# Altium project SenseHost.PrjPcb
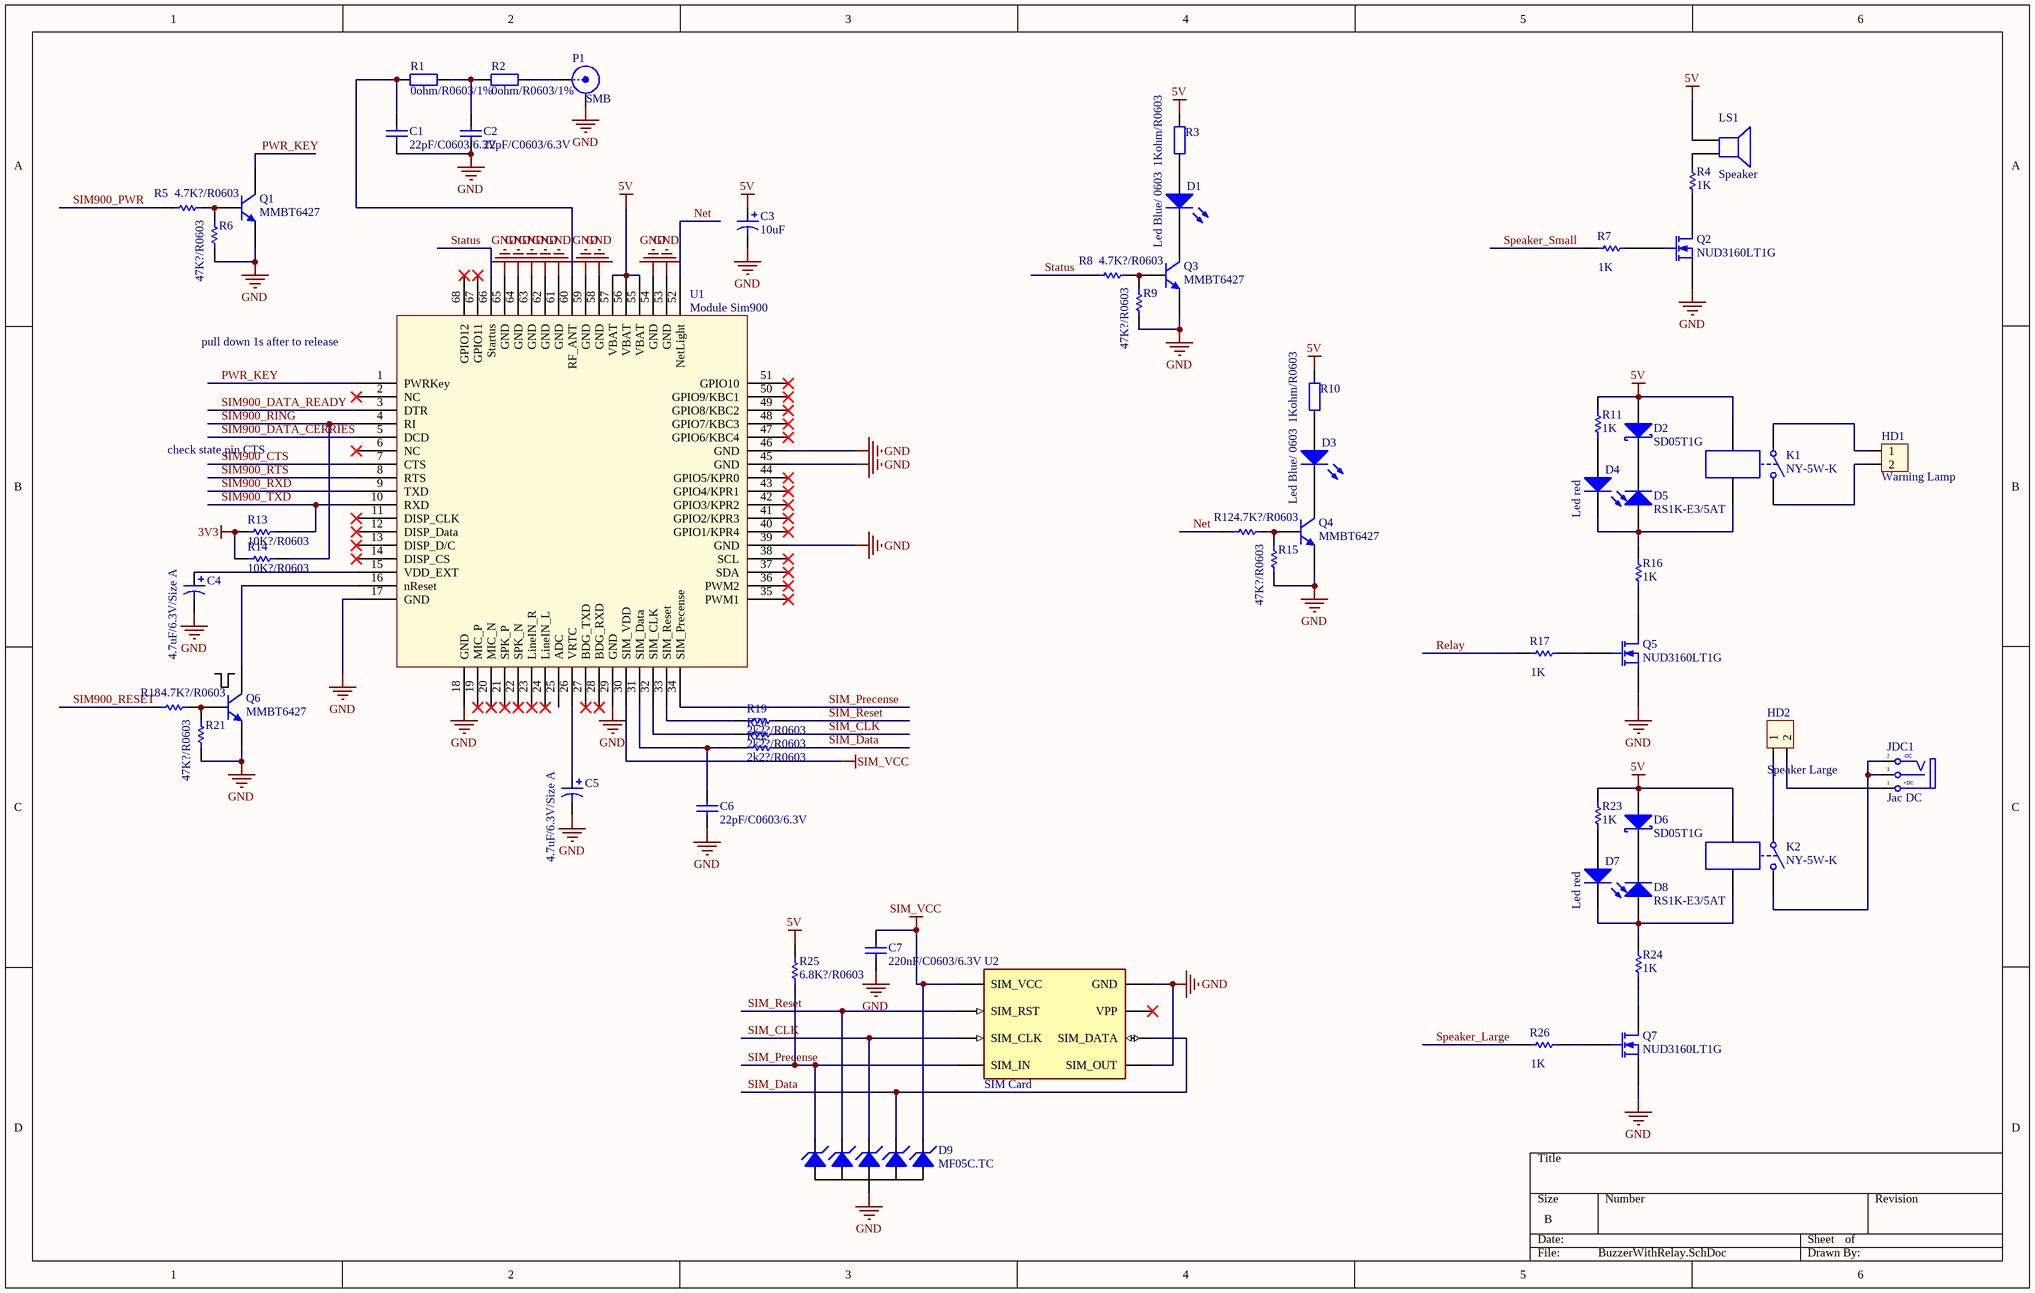
[diagram p0: BuzzerWithRelay.SchDoc]
3 sheets, 160 parts. Net scope: global (net labels, ports and power ports of the same name join across sheets).
Board file: SenseHost.PcbDoc
Sheets:
  BuzzerWithRelay.SchDoc
  MCU_RF.SchDoc
  Power.SchDoc

## Sheet BuzzerWithRelay.SchDoc
size B

### Parts
C1  22pF/C0603/6.3V  [C0603]
C2  22pF/C0603/6.3V  [C0603]
C3  10uF  [Cap size A]
C4  4.7uF/6.3V/Size A  [Cap size A]
C5  4.7uF/6.3V/Size A  [Cap size A]
C6  22pF/C0603/6.3V  [C0603]
C7  220nF/C0603/6.3V  [C0603]
D1  Led Blue/ 0603  [led0603]
D2  SD05T1G  [DO-214AC]
D3  Led Blue/ 0603  [led0603]
D4  Led red  [SM-LED-0805-Red]
D5  RS1K-E3/5AT  [DO-214AC]
D6  SD05T1G  [DO-214AC]
D7  Led red  [SM-LED-0805-Red]
D8  RS1K-E3/5AT  [DO-214AC]
D9  MF05C.TC  [SC70]
HD1  Warning Lamp  [HED2]
HD2  Speaker Large  [HED2]
JDC1  Jac DC  [DC-IN]
K1  NY-5W-K  [Relay NY seri]
K2  NY-5W-K  [Relay NY seri]
LS1  Speaker  [Buzzer]
P1  SMB  [atena MM9329-2700]
Q1  MMBT6427  [SOT 23]
Q2  NUD3160LT1G  [SOT 23]
Q3  MMBT6427  [SOT 23]
Q4  MMBT6427  [SOT 23]
Q5  NUD3160LT1G  [SOT 23]
Q6  MMBT6427  [SOT 23]
Q7  NUD3160LT1G  [SOT 23]
R1  0ohm/R0603/1%  [R0603]
R2  0ohm/R0603/1%  [R0603]
R3  1Kohm/R0603  [R0603]
R4  value 1K  [R0603]  (hidden comment: Res1)
R5  4.7K?/R0603  [R0603]
R6  47K?/R0603  [R0603]
R7  value 1K  [R0603]  (hidden comment: Res1)
R8  4.7K?/R0603  [R0603]
R9  47K?/R0603  [R0603]
R10  1Kohm/R0603  [R0603]
R11  value 1K  [SM-RES-0805]  (hidden comment: Res1)
R12  4.7K?/R0603  [R0603]
R13  10K?/R0603  [R0603]
R14  10K?/R0603  [R0603]
R15  47K?/R0603  [R0603]
R16  value 1K  [SM-RES-0805]  (hidden comment: Res1)
R17  value 1K  [SM-RES-0805]  (hidden comment: Res1)
R18  4.7K?/R0603  [R0603]
R19  2k2?/R0603  [R0603]
R20  2k2?/R0603  [R0603]
R21  47K?/R0603  [R0603]
R22  2k2?/R0603  [R0603]
R23  value 1K  [SM-RES-0805]  (hidden comment: Res1)
R24  value 1K  [SM-RES-0805]  (hidden comment: Res1)
R25  6.8K?/R0603  [R0603]
R26  value 1K  [SM-RES-0805]  (hidden comment: Res1)
U1  Module Sim900  [Sim900]
U2  SIM Card  [SIMCARD]

### Nets
3V3: R13.1 R14.1
5V: C3.1(+) D2.2 D6.2 K1.3 K2.3 LS1.+ R3.2 R10.2 R11.2 R23.2 R25.1 U1.55(VBAT) U1.56(VBAT) U1.57(VBAT)
GND: C1.1 C2.1 C3.2(-) C4.2 C5.2 C6.1 C7.1 D9.2(K) P1.2(Y) Q1.2(E) Q2.2(S) Q3.2(E) Q4.2(E) Q5.2(S) Q6.2(E) Q7.2(S) R6.1 R9.1 R15.1 R21.1 U1.17(GND) U1.18(GND) U1.29(GND) U1.39(GND) U1.45(GND) U1.46(GND) U1.53(GND) U1.54(GND) U1.58(GND) U1.59(GND) U1.61(GND) U1.62(GND) U1.63(GND) U1.64(GND) U1.65(GND) U2.C5(GND) U2.C8(SIM_OUT)
SIM_VCC: C7.2 D9.6(K) U1.30(SIM_VDD) U2.C1(SIM_VCC)
Net: R12.1 U1.52(NetLight)
PWR_KEY: Q1.3(C) U1.1(PWRKey)
Relay: R17.1
SIM900_CTS: U1.7(CTS)
SIM900_DATA_CERRIES: U1.5(DCD)
SIM900_DATA_READY: U1.3(DTR)
SIM900_PWR: R5.1
SIM900_RESET: R18.1
SIM900_RING: R14.2 U1.4(RI)
SIM900_RTS: U1.8(RTS)
SIM900_RXD: U1.9(TXD)
SIM900_TXD: R13.2 U1.10(RXD)
SIM_CLK: D9.4(K) R20.1 U2.C3(SIM_CLK)
SIM_Data: D9.5(K) R22.1 U2.C7(SIM_DATA)
SIM_Precense: D9.1(K) R25.2 U1.34(SIM_Precense) U2.C4(SIM_IN)
SIM_Reset: D9.3(K) R19.1 U2.C2(SIM_RST)
Speaker_Large: R26.1
Speaker_Small: R7.1
Status: R8.1 U1.66(Startus)
NetC1_2: C1.2 R1.2 U1.60(RF_ANT)
NetC2_2: C2.2 R1.1 R2.2
NetC4_1: C4.1 U1.15(VDD_EXT)
NetC5_1: C5.1 U1.26(VRTC)
NetC6_2: C6.2 R22.2 U1.31(SIM_Data)
NetD1_1: D1.1(A) R3.1
NetD1_2: D1.2(K) Q3.3(C)
NetD2_1: D2.1 D5.2(K)
NetD3_1: D3.1(A) R10.1
NetD3_2: D3.2(K) Q4.3(C)
NetD4_1: D4.1(A) R11.1
NetD4_2: D4.2(K) D5.1(A) K1.4 R16.2
NetD6_1: D6.1 D8.2(K)
NetD7_1: D7.1(A) R23.1
NetD7_2: D7.2(K) D8.1(A) K2.4 R24.2
NetHD1_1: HD1.1 K1.1
NetHD1_2: HD1.2 K1.2
NetHD2_1: HD2.1 K2.1
NetHD2_2: HD2.2 JDC1.1(T)
NetJDC1_2: JDC1.2(TN) JDC1.3(S) K2.2
NetLS1_-: LS1.- R4.2
NetP1_1: P1.1(X) R2.1
NetQ1_1: Q1.1(B) R5.2 R6.2
NetQ2_1: Q2.1(G) R7.2
NetQ2_3: Q2.3(D) R4.1
NetQ3_1: Q3.1(B) R8.2 R9.2
NetQ4_1: Q4.1(B) R12.2 R15.2
NetQ5_1: Q5.1(G) R17.2
NetQ5_3: Q5.3(D) R16.1
NetQ6_1: Q6.1(B) R18.2 R21.2
NetQ6_3: Q6.3(C) U1.16(nReset)
NetQ7_1: Q7.1(G) R26.2
NetQ7_3: Q7.3(D) R24.1
NetR19_2: R19.2 U1.33(SIM_Reset)
NetR20_2: R20.2 U1.32(SIM_CLK)

Not connected (* = marked no-connect by the designer): U1 2(NC)* 6(NC)* 11(DISP_CLK)* 12(DISP_Data)* 13(DISP_D/C)* 14(DISP_CS)* 19(MIC_P)* 20(MIC_N)* 21(SPK_P)* 22(SPK_N)* 23(LineIN_R)* 24(LineIN_L)* 25(ADC) 27(BDG_TXD)* 28(BDG_RXD)* 35(PWM1)* 36(PWM2)* 37(SDA)* 38(SCL)* 40(GPIO1/KPR4)* 41(GPIO2/KPR3)* 42(GPIO3/KPR2)* 43(GPIO4/KPR1)* 44(GPIO5/KPR0)* 47(GPIO6/KBC4)* 48(GPIO7/KBC3)* 49(GPIO8/KBC2)* 50(GPIO9/KBC1)* 51(GPIO10)* 67(GPIO11)* 68(GPIO12)*; U2 C6(VPP)*

### Notes on the sheet
- (near U1) pull down 1s after to release
- check state pin CTS
- (in symbol DCIN) -DC; +DC

### Library data of the parts
C1 C2 C6 C7 = Cap: Capacitor; Muf: Murata/Japan; Des: Ceramic Cap; Property: Cap; Price: *
  C1 C2 C6: Ordering: 22pF/C0603/6.3V
  C7: Ordering: 220nF/C0603/6.3V
C3 = 10uF/25V/RADIAL 5X11/20%: Aluminum Electrolytic Capacitors - Leaded 10uF 25V; Manufacturer: Panasonic; Manufacturer Part Number: ECA-1EM100; Tolerance: 20 %; Type: Radial Lead Type; Life: 2000 Hour; Ripple Current: 50 mA; Supplier 1: Mouser; RoHS: RoHS Compliant; Category: Aluminum Electrolytic Capacitors - Leaded; Stock 1: 19378; Pricing 1: 1=0.288, 10=0.117, 100=0.069, 1000=0.061, 2500=0.053, 10000=0.050, 25000=0.048, 50000=0.045 (AUD); Capacitance: 10 uF; Diameter: 5 mm; Dimensions: 5 mm Dia. x 11 mm L; Length: 11 mm; Package / Case: Radial, Can; Packaging: Bulk; Product: General Purpose Electrolytic Capacitors; Series: M; Termination Style: Radial; Voltage Rating DC: 25 V; Brand: Panasonic; Lead Spacing: 2 mm; Lead Style: Straight; Maximum Operating Temperature: + 85 C; Product Category: Radial Electrolytic Aluminum Capacitors; Standard Pack Qty: 200; RoHS - Mouser: Y; Minimum Order Quantity: 1; Reeling: False; ComponentLink1URL: http://www.mouser.com/ds/2/315/ABA0000CE12-465472.pdf; ComponentLink1Description: http://www.mouser.com/ds/2/315/ABA0000CE12-465472.pdf
C4 C5 = Cap Pol1: Polarized Capacitor (Radial); Muf: Vishay; Property: Tantalum Cap; Ordering: 4.7uF/6.3V/Size A; Price: *; Des: *
D1 D3 = LED0: Typical INFRARED GaAs LED; Muf: China Mainland; Ordering: Led Blue/ 0603; Price: *; Des: *; Property: Led
D2 D6 = Transil: Des: SD05T1 Series 7.3V 350W Uni Directiional Transient Voltage Suppressor - SOD-323; Muf: ON; Property: TVS; Ordering: SD05T1G; Value: SD05T1G; Price: 0.09
D4 D7 = LED0: Typical INFRARED GaAs LED; Des: Led singal; Muf: Everlight; Value: Led red; Price: 0.02; Ordering: Led 0805; Property: Led
D5 D8 = Diode: Default Diode; Des: RS1K Series 800 V 1 A Surface Mount Fast Switching Rectifier - DO-214AC; Muf: VISHAY; Value: RS1K-E3/5AT; Property: Diode; Price: 0.05; Ordering: RS1K-E3/5AT
D9 = SMF05C: TVS Diode Array  For ESD and Latch-Up Protection; Muf: SEMTECH/USA; Ordering: MF05C.TC; Price: *; Des: TVS Diode Array; Property: TVS Diode
HD1 HD2 = Hed2: Header 2 (Green); Value: Header 2
JDC1 = DCIN: Jac DC input; Value: Jac DC
K1 K2 = Relay-SPST: Single-Pole Single-Throw Relay; Muf: Fujitsu; Des: General Purpose Relays POWER; Property: Power Relays; Ordering: NY-5W-K; Price: 2.27; Value: NY-5W-K
LS1 = Speaker: Loudspeaker; Published: 24-Mar-1999; LatestRevisionDate: 17-Jul-2002; LatestRevisionNote: Re-released for DXP Platform.; PackageReference: PIN2; Publisher: Altium Limited
P1 = SMB: SMB Straight Connector; LatestRevisionDate: 17-Jul-2002; LatestRevisionNote: Re-released for DXP Platform.; Publisher: Altium Limited
Q1 Q3 Q4 Q6 = NPN: NPN Bipolar Transistor; Muf: Fairchild; Ordering: MMBT6427; Des: *; Property: *; Price: 0.4RMB
Q2 Q5 Q7 = MOSFET-N: SSM3K337R; Des: MOSFET 61V Industrial Load Driver; Muf: ON Semiconductor; Property: Mosfet; Price: 0.57; Ordering: NUD3160LT1G; Value: NUD3160LT1G
R1 R2 = Res2: Resistor; Property: Res; Muf: China Mainland; Ordering: 0ohm/R0603/1%; Des: *; Price: *
R3 R10 = Res2: Resistor; Property: Res; Ordering: 1Kohm/R0603; Vishay/USA: *; Price: 0.023RMB; Des: *
R4 R7 R11 R16 R17 R23 R24 R26 = Res1: Resistor; Published: 8-Jun-2000; LatestRevisionDate: 17-Jul-2002; LatestRevisionNote: Re-released for DXP Platform.; PackageReference: AXIAL-0.3; Publisher: Altium Limited; PackageDescription: Axial Device, Thru-Hole; 2 Leads; 0.3 in Pin Spacing
R5 R6 R8 R9 R12-R15 R18-R22 R25 = Res1: Resistor; Muf: Vishay/USA; Property: Res; Des: *
  R5 R8 R12 R18: Ordering: 4.7K?/R0603
  R6 R9 R15 R21: Ordering: 47K?/R0603
  R13 R14: Ordering: 10K?/R0603
  R19 R20 R22: Ordering: 2k2?/R0603
  R25: Ordering: 6.8K?/R0603
U1 = SIM900: GSM-GPRS; Muf: SimCom; Price: *; Des: *; Property: Module; Ordering: Module Sim900

## Sheet MCU_RF.SchDoc
size B
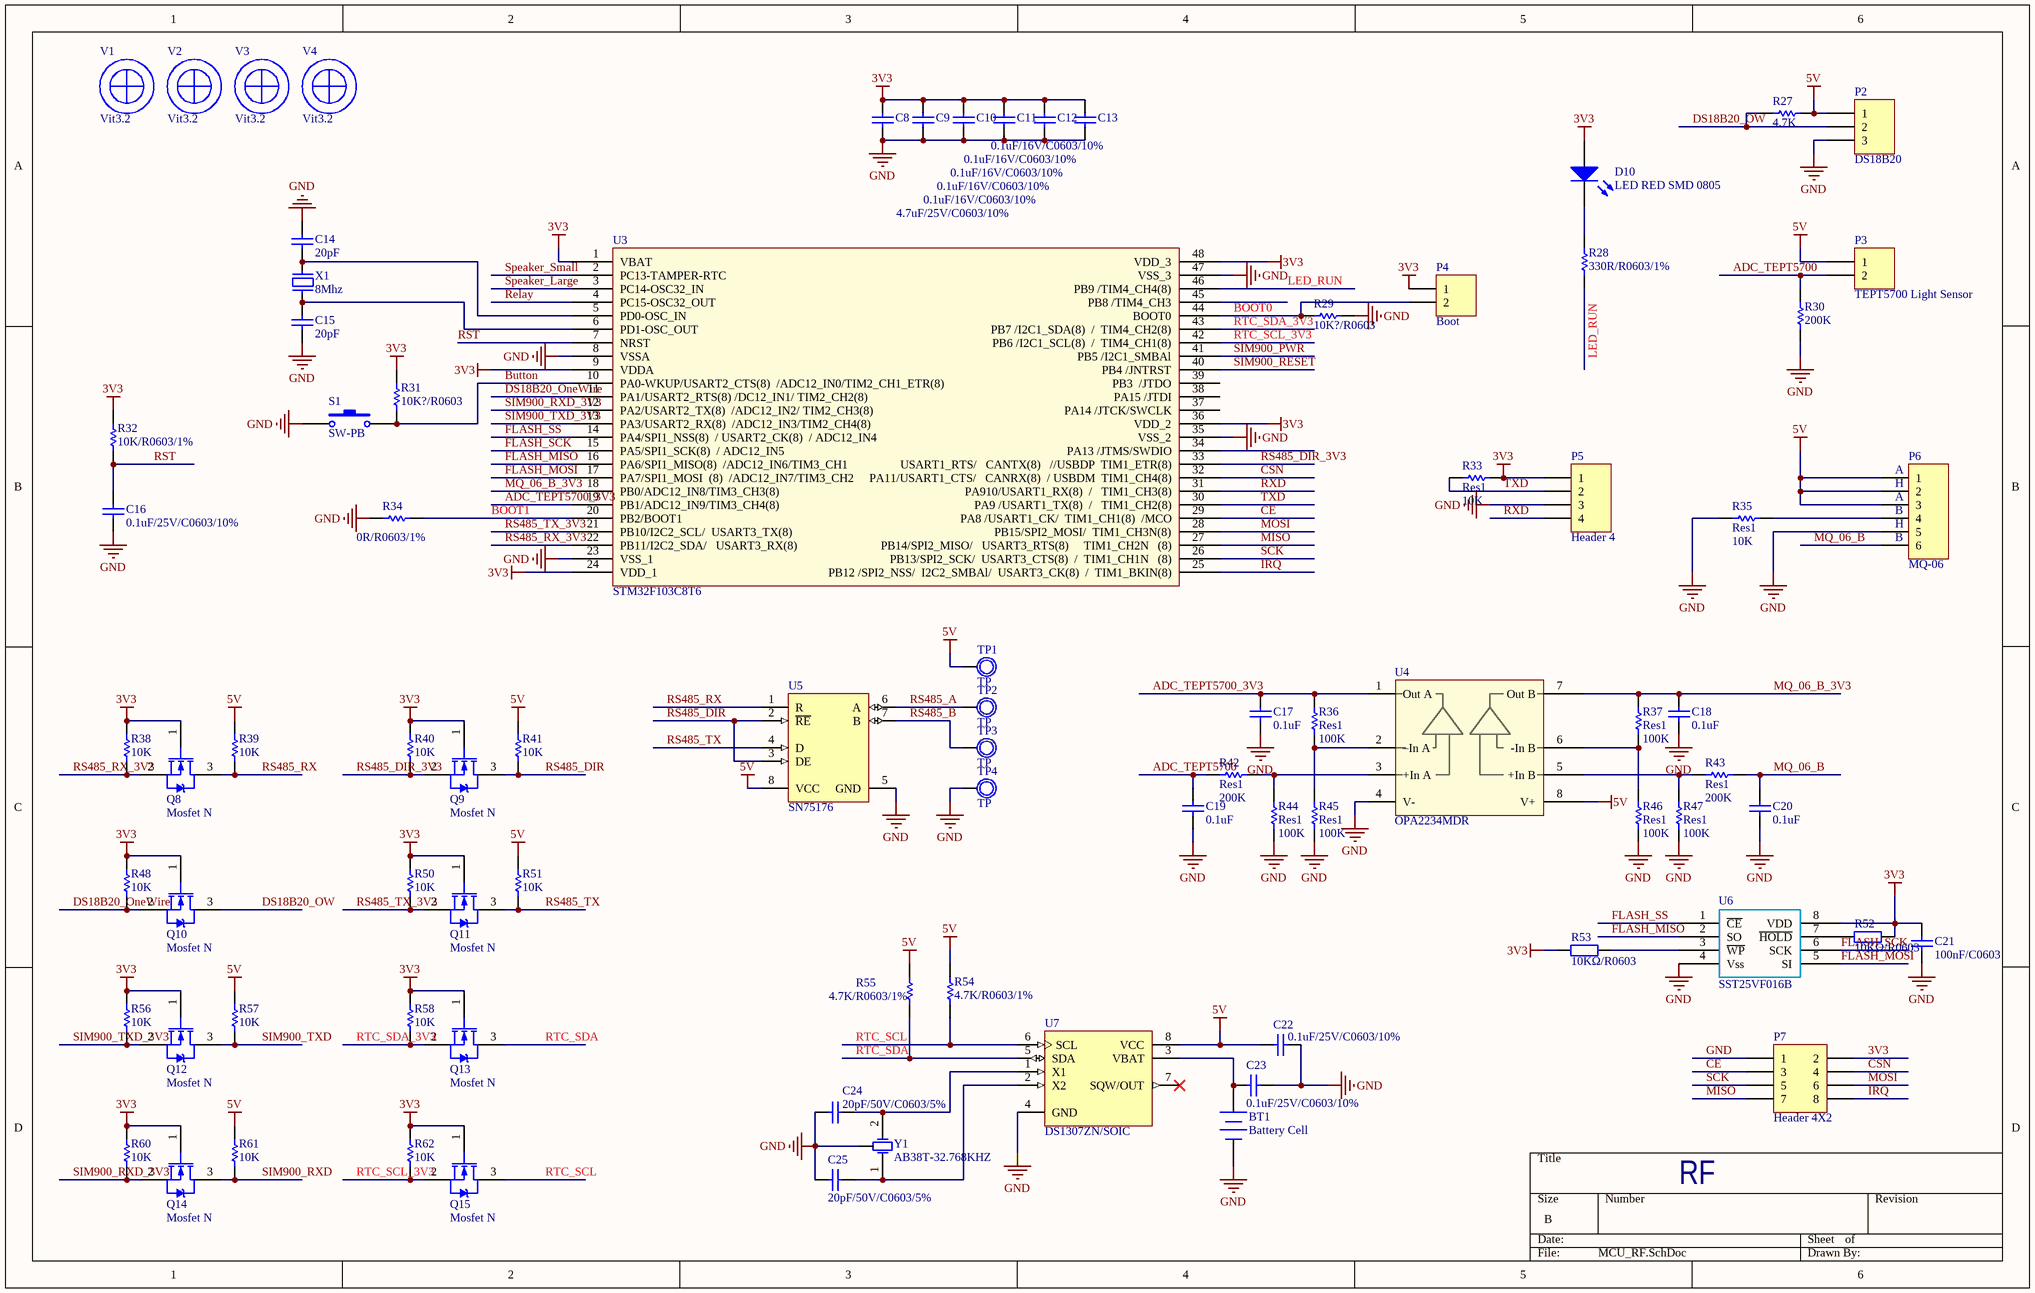
[diagram p1: MCU_RF.SchDoc]

### Parts
BT1  Battery Cell  [Battery CELL_HOLDER]
C8  4.7uF/25V/C0603/10%  [C0603]
C9  0.1uF/16V/C0603/10%  [C0603]
C10  0.1uF/16V/C0603/10%  [C0603]
C11  0.1uF/16V/C0603/10%  [C0603]
C12  0.1uF/16V/C0603/10%  [C0603]
C13  0.1uF/16V/C0603/10%  [C0603]
C14  20pF  [C0603]
C15  20pF  [C0603]
C16  0.1uF/25V/C0603/10%  [C0603]
C17  0.1uF  [C0603]
C18  0.1uF  [C0603]
C19  0.1uF  [C0603]
C20  0.1uF  [C0603]
C21  100nF/C0603  [c0603]
C22  0.1uF/25V/C0603/10%  [C0603]
C23  0.1uF/25V/C0603/10%  [C0603]
C24  20pF/50V/C0603/5%  [C0603]
C25  20pF/50V/C0603/5%  [C0603]
D10  LED RED SMD 0805  [led0805]
P2  DS18B20  [HDR1X3]
P3  TEPT5700 Light Sensor  [LED-5-BLUE]
P4  Boot  [HDR1X2]
P5  Header 4  [HDR1X4]
P6  MQ-06  [MQ-02]
P7  Header 4X2  [HDR2X4]
Q8  Mosfet N  [SOT 23]
Q9  Mosfet N  [SOT 23]
Q10  Mosfet N  [SOT 23]
Q11  Mosfet N  [SOT 23]
Q12  Mosfet N  [SOT 23]
Q13  Mosfet N  [SOT 23]
Q14  Mosfet N  [SOT 23]
Q15  Mosfet N  [SOT 23]
R27  value 4.7K  [SM-RES-0805]  (hidden comment: Res1)
R28  330R/R0603/1%  [R0603]
R29  10K?/R0603  [R0603]
R30  value 200K  [SM-RES-0805]  (hidden comment: Res1)
R31  10K?/R0603  [R0603]
R32  10K/R0603/1%  [R0603]
R33  Res1  value 10K  [R0603]
R34  0R/R0603/1%  [R0603]
R35  Res1  value 10K  [SM-RES-0805]
R36  Res1  value 100K  [R0603]
R37  Res1  value 100K  [R0603]
R38  10K  [R0603]
R39  10K  [R0603]
R40  10K  [R0603]
R41  10K  [R0603]
R42  Res1  value 200K  [R0603]
R43  Res1  value 200K  [R0603]
R44  Res1  value 100K  [R0603]
R45  Res1  value 100K  [R0603]
R46  Res1  value 100K  [R0603]
R47  Res1  value 100K  [R0603]
R48  10K  [R0603]
R50  10K  [R0603]
R51  10K  [R0603]
R52  10KΩ/R0603  [r0603]
R53  10KΩ/R0603  [r0603]
R54  4.7K/R0603/1%  [R0603]
R55  4.7K/R0603/1%  [R0603]
R56  10K  [R0603]
R57  10K  [R0603]
R58  10K  [R0603]
R60  10K  [R0603]
R61  10K  [R0603]
R62  10K  [R0603]
S1  SW-PB  [Button-2pin]
TP1  TP  [TP1]
TP2  TP  [TP1]
TP3  TP  [TP1]
TP4  TP  [TP1]
U3  STM32F103C8T6  [ST_TSQFP50P910X910X160-48N]
U4  OPA2234MDR  [SOP 8Pin]
U5  SN75176  [SOP127P600X175-8N]
U6  SST25VF016B  [SOIC8]
U7  DS1307ZN/SOIC  [SOIC-8]
V1  Vit3.2  [Vit3.2]
V2  Vit3.2  [Vit3.2]
V3  Vit3.2  [Vit3.2]
V4  Vit3.2  [Vit3.2]
X1  8Mhz  [XT2]
Y1  AB38T-32.768KHZ  [ZTA - 38k]

### Nets
3V3: C8.2 C9.2 C10.2 C11.2 C12.2 C13.2 C21.2 D10.1(A) P4.1 P5.1 P7.2 Q8.1(G) Q9.1(G) Q10.1(G) Q11.1(G) Q12.1(G) Q13.1(G) Q14.1(G) Q15.1(G) R31.1 R32.2 R33.2 R38.1 R40.1 R48.1 R50.1 R52.2 R53.1 R56.1 R58.1 R60.1 R62.1 U3.1(VBAT) U3.9(VDDA) U3.24(VDD_1) U3.36(VDD_2) U3.48(VDD_3) U6.8(VDD)
5V: C22.2 P2.1 P3.1 P6.1 P6.2 P6.3 R27.1 R39.1 R41.1 R51.1 R54.2 R55.2 R57.1 R61.1 TP1.1 U4.8(V+) U5.8(VCC) U7.8(VCC)
GND: BT1.2(-) C8.1 C9.1 C10.1 C11.1 C12.1 C13.1 C14.2 C15.1 C16.1 C17.2 C18.2 C19.2 C20.2 C21.1 C22.1 C23.1 C24.1 C25.1 P2.3 P5.3 P6.5 P7.1 R29.1 R30.1 R34.1 R35.1 R44.1 R45.1 R46.1 R47.1 S1.1 TP4.1 U3.8(VSSA) U3.23(VSS_1) U3.35(VSS_2) U3.47(VSS_3) U4.4(V-) U5.5(GND) U6.4(Vss) U7.4(GND) Y1.3(GND)
ADC_TEPT5700: C19.1 P3.2 R30.2 R42.1
ADC_TEPT5700_3V3: C17.1 R36.2 U3.19(PB1/ADC12_IN9/TIM3_CH4(8)) U4.1(Out_A)
BOOT0: P4.2 R29.2 U3.44(BOOT0)
BOOT1: R34.2 U3.20(PB2/BOOT1)
Button: R31.2 S1.2 U3.10(PA0-WKUP/USART2_CTS(8)__/ADC12_IN0/TIM2_CH1_ETR(8))
CE: P7.3 U3.29(PA8_/USART1_CK/__TIM1_CH1(8)__/MCO)
CSN: P7.4 U3.32(PA11/USART1_CTS/___CANRX(8)__/_USBDM__TIM1_CH4(8))
DS18B20_OneWire: Q10.2(S) R48.2 U3.11(PA1/USART2_RTS(8)_/DC12_IN1/_TIM2_CH2(8))
DS18B20_OW: P2.2 Q10.3(D) R27.2
FLASH_MISO: U3.16(PA6/SPI1_MISO(8)__/ADC12_IN6/TIM3_CH1) U6.2(SO)
FLASH_MOSI: U3.17(PA7/SPI1_MOSI__(8)__/ADC12_IN7/TIM3_CH2) U6.5(SI)
FLASH_SCK: U3.15(PA5/SPI1_SCK(8)__/_ADC12_IN5) U6.6(SCK)
FLASH_SS: U3.14(PA4/SPI1_NSS(8)__/_USART2_CK(8)__/_ADC12_IN4) U6.1(~{CE})
IRQ: P7.8 U3.25(PB12_/SPI2_NSS/__I2C2_SMBAl/__USART3_CK(8)__/__TIM1_BKIN(8))
LED_RUN: R28.2 U3.46(PB9_/TIM4_CH4(8))
MISO: P7.7 U3.27(PB14/SPI2_MISO/___USART3_RTS(8)_____TIM1_CH2N___(8))
MOSI: P7.6 U3.28(PB15/SPI2_MOSI/__TIM1_CH3N(8))
MQ_06_B: C20.1 P6.6 R43.2
MQ_06_B_3V3: C18.1 R37.2 U3.18(PB0/ADC12_IN8/TIM3_CH3(8)) U4.7(Out_B)
Relay: U3.4(PC15-OSC32_OUT)
RS485_A: TP2.1 U5.6(A)
RS485_B: TP3.1 U5.7(B)
RS485_DIR: Q9.3(D) R41.2 U5.2(~{RE}) U5.3(DE)
RS485_DIR_3V3: Q9.2(S) R40.2 U3.33(USART1_RTS/___CANTX(8)___//USBDP__TIM1_ETR(8))
RS485_RX: Q8.3(D) R39.2 U5.1(R)
RS485_RX_3V3: Q8.2(S) R38.2 U3.22(PB11/I2C2_SDA/___USART3_RX(8))
RS485_TX: Q11.3(D) R51.2 U5.4(D)
RS485_TX_3V3: Q11.2(S) R50.2 U3.21(PB10/I2C2_SCL/__USART3_TX(8))
RST: C16.2 R32.1 U3.7(NRST)
RTC_SCL: Q15.3(D) R54.1 U7.6(SCL)
RTC_SCL_3V3: Q15.2(S) R62.2 U3.42(PB6_/I2C1_SCL(8)__/__TIM4_CH1(8))
RTC_SDA: Q13.3(D) R55.1 U7.5(SDA)
RTC_SDA_3V3: Q13.2(S) R58.2 U3.43(PB7_/I2C1_SDA(8)__/__TIM4_CH2(8))
RXD: P5.4 U3.31(PA910/USART1_RX(8)__/___TIM1_CH3(8))
SCK: P7.5 U3.26(PB13/SPI2_SCK/__USART3_CTS(8)__/__TIM1_CH1N___(8))
SIM900_PWR: U3.41(PB5_/I2C1_SMBAl)
SIM900_RESET: U3.40(PB4_/JNTRST)
SIM900_RXD: Q14.3(D) R61.2
SIM900_RXD_3V3: Q14.2(S) R60.2 U3.12(PA2/USART2_TX(8)__/ADC12_IN2/_TIM2_CH3(8))
SIM900_TXD: Q12.3(D) R57.2
SIM900_TXD_3V3: Q12.2(S) R56.2 U3.13(PA3/USART2_RX(8)__/ADC12_IN3/TIM2_CH4(8))
Speaker_Large: U3.3(PC14-OSC32_IN)
Speaker_Small: U3.2(PC13-TAMPER-RTC)
TXD: P5.2 R33.1 U3.30(PA9_/USART1_TX(8)__/___TIM1_CH2(8))
NetBT1_1: BT1.1(+) C23.2 U7.3(VBAT)
NetC14_1: C14.1 U3.5(PD0-OSC_IN) X1.2
NetC15_2: C15.2 U3.6(PD1-OSC_OUT) X1.1
NetC24_2: C24.2 U7.1(X1) Y1.2(OSC2)
NetC25_2: C25.2 U7.2(X2) Y1.1(OSC1)
NetD10_2: D10.2(K) R28.1
NetP6_4: P6.4 R35.2
NetR36_1: R36.1 R45.2 U4.2(–In_A)
NetR37_1: R37.1 R46.2 U4.6(-In_B)
NetR42_2: R42.2 R44.2 U4.3(+In_A)
NetR43_1: R43.1 R47.2 U4.5(+In_B)
NetR52_1: R52.1 U6.7(~{HOLD})
NetR53_2: R53.2 U6.3(~{WP})

Not connected (* = marked no-connect by the designer): U3 34(PA13_/JTMS/SWDIO) 37(PA14_/JTCK/SWCLK) 38(PA15_/JTDI) 39(PB3__/JTDO) 45(PB8_/TIM4_CH3); U7 7(SQW/OUT)*

### Notes on the sheet
- (near P6) A
- (near P6) H
- (near P6) B
- RF

### Library data of the parts
BT1 = Battery Holder Cell 20mm: HOLDER COINCELL 2032 RETAINRCLIP; Manufacturer: MPD (Memory Protection Devices); Manufacturer Part Number: BS-7; Battery Type, Function: Coin Cell, Holder; Style: Holder (Open); Battery Cell Size: Coin, 20.0mm; Number of Cells: 1; Battery Series: 2032; Supplier 1: Digi-Key; RoHS: RoHS Compliant; Category: Battery Products; Stock 1: 37883; Pricing 1: 1=0.77, 10=0.71, 100=0.64, 500=0.58, 1000=0.46 (USD); Mounting Type: PCB, Through Hole; Termination Style: PC Pin; Height Above Board: 0.354" (9.00mm); Operating Temperature: -55°C ~ 105°C; ComponentLink1URL: http://www.memoryprotectiondevices.com/datasheets/BS-7-datasheet.pdf; ComponentLink1Description: http://www.memoryprotectiondevices.com/datasheets/BS-7-datasheet.pdf; Supplier Part Number 1: BS-7-ND
C8 = 4.7uF/25V/C0603/10%: CAP CER 4.7UF 25V 10% X6S 0603; Manufacturer: Murata Electronics North America; Manufacturer Part Number: GRM188C81E475KE11D; Capacitance: 4.7µF; Supplier 1: Digi-Key; RoHS: RoHS Compliant; Category: Capacitors; Stock 1: 57548; Pricing 1: 1=0.42, 10=0.368, 50=0.2236, 100=0.1841, 250=0.14728, 500=0.13414, 1000=0.12098 (USD); Packaging: Digi-Reel®; Tolerance: ±10%; Voltage - Rated: 25V; Temperature Coefficient: X6S; Mounting Type: Surface Mount, MLCC; Operating Temperature: -55°C ~ 105°C; Applications: General Purpose; Ratings: -; Package / Case: 0603 (1608 Metric); Size / Dimension: 0.063" L x 0.031" W (1.60mm x 0.80mm); Height - Seated (Max): -; Thickness (Max): 0.039" (1.00mm); Lead Spacing: -; Features: -; Lead Style: -; ComponentLink1URL: http://www.murata.com/~/media/webrenewal/support/library/catalog/products/capacitor/mlcc/c02e.ashx; ComponentLink1Description: http://www.murata.com/~/media/webrenewal/support/library/catalog/products/capacitor/mlcc/c02e.ashx
C9-C13 = 0.1uF/16V/C0603/10%: CAP CER 0.1UF 16V 10% X7R 0603; Manufacturer: Kemet; Manufacturer Part Number: C0603C104K4RACTU; Capacitance: 0.1µF; Supplier 1: Digi-Key; RoHS: RoHS Compliant; Category: Capacitors; Stock 1: 2315544; Pricing 1: 1=0.1, 10=0.022, 25=0.0156, 50=0.012, 100=0.0101, 250=0.00828, 1000=0.0054 (USD); Packaging: Cut Tape (CT); Tolerance: ±10%; Voltage - Rated: 16V; Temperature Coefficient: X7R; Mounting Type: Surface Mount, MLCC; Operating Temperature: -55°C ~ 125°C; Applications: General Purpose; Ratings: -; Package / Case: 0603 (1608 Metric); Size / Dimension: 0.063" L x 0.031" W (1.60mm x 0.80mm); Height - Seated (Max): -; Thickness (Max): 0.034" (0.87mm); Lead Spacing: -; Features: -; Lead Style: -; ComponentLink1URL: http://www.kemet.com/docfinder?Partnumber=C0603C104K4RACTU; ComponentLink1Description: http://www.kemet.com/docfinder?Partnumber=C0603C104K4RACTU; Supplier Part Number 1: 399-1096-1-ND
C14 C15 = Cap: Capacitor; Ordering: 10pF/C0603/6.3V; Muf: Murata/Japan; Des: Ceramic Cap; Property: Cap; Price: *
C16-C20 C22 C23 = 0.1uF/25V/C0603/10%: CAP CER 0.1UF 25V 10% X7R 0603; Manufacturer: Murata Electronics North America; Manufacturer Part Number: GRM188R71E104KA01D; Capacitance: 0.1µF; Supplier 1: Digi-Key; RoHS: RoHS Compliant; Category: Capacitors; Stock 1: 8148157; Pricing 1: 1=0.1, 10=0.019, 50=0.0104, 100=0.0088, 250=0.0072, 500=0.00616, 1000=0.0048 (USD); Packaging: Cut Tape (CT); Tolerance: ±10%; Voltage - Rated: 25V; Temperature Coefficient: X7R; Mounting Type: Surface Mount, MLCC; Operating Temperature: -55°C ~ 125°C; Applications: General Purpose; Ratings: -; Package / Case: 0603 (1608 Metric); Size / Dimension: 0.063" L x 0.031" W (1.60mm x 0.80mm); Height - Seated (Max): -; Thickness (Max): 0.035" (0.90mm); Lead Spacing: -; Features: -; Lead Style: -; ComponentLink1URL: http://www.murata.com/~/media/webrenewal/support/library/catalog/products/capacitor/mlcc/c02e.ashx; ComponentLink1Description: http://www.murata.com/~/media/webrenewal/support/library/catalog/products/capacitor/mlcc/c02e.ashx
C21 = Cap: Capacitor; Published: 8-Jun-2000; LatestRevisionDate: 17-Jul-2002; LatestRevisionNote: Re-released for DXP Platform.; PackageReference: RAD-0.3; Publisher: Altium Limited; Value: 100nF/C0603
C24 C25 = 20pF/50V/C0603/5%: CAP CER 20PF 50V 5% NP0 0603; Manufacturer: Samsung Electro-Mechanics America, Inc.; Manufacturer Part Number: CL10C200JB8NNNC; Temperature Coefficient: C0G, NP0; Supplier 1: Digi-Key; RoHS: RoHS Compliant; Category: Capacitors; Stock 1: 129313; Pricing 1: 1=0.1, 10=0.031, 25=0.0216, 100=0.0141, 500=0.00986, 1000=0.00768 (USD); Packaging: Cut Tape (CT); Capacitance: 20pF; Tolerance: ±5%; Voltage - Rated: 50V; Mounting Type: Surface Mount, MLCC; Operating Temperature: -55°C ~ 125°C; Applications: General Purpose; Ratings: -; Package / Case: 0603 (1608 Metric); Size / Dimension: 0.063" L x 0.031" W (1.60mm x 0.80mm); Height - Seated (Max): -; Thickness (Max): 0.035" (0.90mm); Lead Spacing: -; Features: -; Lead Style: -; ComponentLink1URL: http://www.samsungsem.com/kr/support/product-search/mlcc/CL10C200JB8NNNC.jsp; ComponentLink1Description: http://www.samsungsem.com/kr/support/product-search/mlcc/CL10C200JB8NNNC.jsp
D10 = LED RED SMD 0805: LED RED DIFFUSED 0805 SMD; Manufacturer: OSRAM Opto Semiconductors Inc.; Manufacturer Part Number: LH R974-LP-1; Wavelength - Dominant: 645nm; Wavelength - Peak: 660nm; Millicandela Rating: 41mcd; Voltage - Forward (Vf) (Typ): 1.8V; Current - Test: 20mA; Viewing Angle: 160°; Lens Color: White; Lens Style/Size: Rectangle with Flat Top, 1.30mm x 1.25mm; Supplier 1: Digi-Key; RoHS: RoHS Compliant; Category: Optoelectronics; Stock 1: 72062; Pricing 1: 1=0.26, 10=0.207, 25=0.1792, 100=0.1131, 250=0.0754, 500=0.06408, 1000=0.049 (USD); Packaging: Cut Tape (CT); Color: Red; Lens Transparency: Diffused; Package / Case: 0805 (2012 Metric); Supplier Device Package: *; Size / Dimension: 2.00mm L x 1.25mm W; Height (Max): 0.90mm; Mounting Type: Surface Mount; ComponentLink1URL: http://www.osram-os.com/Graphics/XPic8/00078869_0.pdf; ComponentLink1Description: http://www.osram-os.com/Graphics/XPic8/00078869_0.pdf
P2 = Header 3: Header, 3-Pin; LatestRevisionDate: 17-Jul-2002; LatestRevisionNote: Re-released for DXP Platform.; Publisher: Altium Limited
P3 P4 = Header 2: Header, 2-Pin; LatestRevisionDate: 17-Jul-2002; LatestRevisionNote: Re-released for DXP Platform.; Publisher: Altium Limited
P5 = Header 4: Header, 4-Pin; LatestRevisionDate: 17-Jul-2002; LatestRevisionNote: Re-released for DXP Platform.; Publisher: Altium Limited
P6 = Header 6: Header, 6-Pin; LatestRevisionDate: 17-Jul-2002; LatestRevisionNote: Re-released for DXP Platform.; Publisher: Altium Limited
P7 = Header 4X2: Header, 4-Pin, Dual row; LatestRevisionDate: 17-Jul-2002; LatestRevisionNote: Re-released for DXP Platform.; Publisher: Altium Limited
R27 R30 R33 R35-R37 R42-R47 = Res1: Resistor; Published: 8-Jun-2000; LatestRevisionDate: 17-Jul-2002; LatestRevisionNote: Re-released for DXP Platform.; PackageReference: AXIAL-0.3; Publisher: Altium Limited; PackageDescription: Axial Device, Thru-Hole; 2 Leads; 0.3 in Pin Spacing
R28 = 330R/R0603/1%: RES SMD 330 OHM 1% 1/10W 0603; Manufacturer: Yageo; Manufacturer Part Number: RC0603FR-07330RL; Resistance (Ohms): 330; Power (Watts): 0.1W, 1/10W; Temperature Coefficient: ±100ppm/°C; Supplier 1: Digi-Key; RoHS: RoHS Compliant; Category: Resistors; Stock 1: 464448; Pricing 1: 1=0.1, 10=0.014, 25=0.01, 100=0.0057, 250=0.00436, 500=0.00348, 1000=0.00257, 2500=0.00223 (USD); Packaging: Cut Tape (CT); Tolerance: ±1%; Composition: Thick Film; Features: Moisture Resistant; Operating Temperature: -55°C ~ 155°C; Package / Case: 0603 (1608 Metric); Supplier Device Package: 0603; Size / Dimension: 0.063" L x 0.031" W (1.60mm x 0.80mm); Height: 0.022" (0.55mm); Number of Terminations: 2; ComponentLink1URL: http://www.yageo.com/NewPortal/yageodocoutput?fileName=/pdf/R-Chip/PYu-RC_Group_51_RoHS_L_3.pdf; ComponentLink1Description: http://www.yageo.com/NewPortal/yageodocoutput?fileName=/pdf/R-Chip/PYu-RC_Group_51_RoHS_L_3.pdf
R29 R31 = Res1: Resistor; Muf: Vishay/USA; Property: Res; Ordering: 10K?/R0603; Des: *
R32 = 10M/R0603/1%: RES SMD 10M OHM 1% 1/10W 0603; Manufacturer: Yageo; Manufacturer Part Number: RC0603FR-0710ML; Power (Watts): 0.1W, 1/10W; Temperature Coefficient: ±100ppm/°C; Supplier 1: Digi-Key; RoHS: RoHS Compliant; Category: Resistors; Stock 1: 620000; Pricing 1: 5000=0.00175, 10000=0.00152, 25000=0.00133, 50000=0.00122, 125000=0.0012 (USD); Packaging: Tape & Reel (TR); Resistance (Ohms): 10M; Tolerance: ±1%; Composition: Thick Film; Features: Moisture Resistant; Operating Temperature: -55°C ~ 155°C; Package / Case: 0603 (1608 Metric); Supplier Device Package: 0603; Size / Dimension: 0.063" L x 0.031" W (1.60mm x 0.80mm); Height: 0.022" (0.55mm); Number of Terminations: 2; ComponentLink1URL: http://www.yageo.com/NewPortal/yageodocoutput?fileName=/pdf/R-Chip/PYu-RC_Group_51_RoHS_L_3.pdf; ComponentLink1Description: http://www.yageo.com/NewPortal/yageodocoutput?fileName=/pdf/R-Chip/PYu-RC_Group_51_RoHS_L_3.pdf; Supplier Part Number 1: 311-10.0MHRTR-ND
R34 = 0R/R0603/1%: RES SMD 0.01 OHM 1% 1/10W 0603; Manufacturer: Yageo; Manufacturer Part Number: RL0603FR-070R01L; Resistance (Ohms): 0.01; Power (Watts): 0.1W, 1/10W; Temperature Coefficient: ±1500ppm/°C; Supplier 1: Digi-Key; RoHS: RoHS Compliant; Category: Resistors; Stock 1: 30355; Pricing 1: 1=0.76, 10=0.546, 25=0.426, 100=0.2839, 250=0.24024, 500=0.19656, 1000=0.15288, 2500=0.14742 (USD); Packaging: Cut Tape (CT); Tolerance: ±1%; Composition: Thick Film; Features: Current Sense, Moisture Resistant; Operating Temperature: -55°C ~ 155°C; Package / Case: 0603 (1608 Metric); Supplier Device Package: 0603; Size / Dimension: 0.063" L x 0.031" W (1.60mm x 0.80mm); Height: 0.022" (0.55mm); Number of Terminations: 2; ComponentLink1URL: http://www.yageo.com/documents/recent/PYu-RL_Group_521_RoHS_L_1.pdf; ComponentLink1Description: http://www.yageo.com/documents/recent/PYu-RL_Group_521_RoHS_L_1.pdf; Supplier Part Number 1: 311-.01QCT-ND
R38-R41 R48 R50 R51 R54-R58 R60-R62 = 4.7K/R0603/1%: RES SMD 4.7K OHM 1% 1/10W 0603; Manufacturer: Yageo; Manufacturer Part Number: RC0603FR-074K7L; Power (Watts): 0.1W, 1/10W; Temperature Coefficient: ±100ppm/°C; Supplier 1: Digi-Key; RoHS: RoHS Compliant; Category: Resistors; Stock 1: 3295420; Pricing 1: 1=0.1, 10=0.014, 25=0.01, 100=0.0057, 250=0.00436, 500=0.00348, 1000=0.00257, 2500=0.00223 (USD); Packaging: Cut Tape (CT); Resistance (Ohms): 4.7k; Tolerance: ±1%; Composition: Thick Film; Features: Moisture Resistant; Operating Temperature: -55°C ~ 155°C; Package / Case: 0603 (1608 Metric); Supplier Device Package: 0603; Size / Dimension: 0.063" L x 0.031" W (1.60mm x 0.80mm); Height: 0.022" (0.55mm); Number of Terminations: 2; ComponentLink1URL: http://www.yageo.com/NewPortal/yageodocoutput?fileName=/pdf/R-Chip/PYu-RC_Group_51_RoHS_L_3.pdf; ComponentLink1Description: http://www.yageo.com/NewPortal/yageodocoutput?fileName=/pdf/R-Chip/PYu-RC_Group_51_RoHS_L_3.pdf; Supplier Part Number 1: 311-4.70KHRCT-ND
R52 R53 = Res2: Resistor; Ordering: 10KΩ/R0603; Muf: *; Property: Resistor; Des: *; Price: *
S1 = SW-PB: Switch; Published: 24-Mar-1999; LatestRevisionDate: 17-Jul-2002; LatestRevisionNote: Re-released for DXP Platform.; PackageReference: SPST-2; Publisher: Altium Limited
TP1-TP4 = TP1: Test Point; Value: Test Point
U3 = STM32F103C8T6: Medium-density performance line ARM-based 32-bit MCU with 64 or  128 KB Flash, USB, CAN, 7 timers, 2 ADCs, 9 communication interfaces
U4 = OPA2234M: LOW-POWER, PRECISION  SINGLE-SUPPLY OPERATIONAL AMPLIFIERS; Muf: TI/USA; Property: IC; Des: LOW-POWER, PRECISION  SINGLE-SUPPLY OPERATIONAL AMPLIFIERS; Ordering: OPA2234MDR; Price: 5RMB
U5 = SN75176_RS485: RS485 Interface
U7 = DS1307ZN+T&R: IC RTC CLK/CALENDAR I2C 8-SOIC; Manufacturer: Maxim Integrated; Memory Size: 56B; Time Format: HH:MM:SS (12/24 hr); Date Format: YY-MM-DD-dd; Interface: I²C, 2-Wire Serial; Voltage - Supply: 4.5 V ~ 5.5 V; Voltage - Supply, Battery: 2 V ~ 3.5 V; Current - Timekeeping (Max): 200µA @ 5V; Supplier 1: Digi-Key; Manufacturer Part Number: DS1307ZN+T&R; RoHS: RoHS Compliant; Category: Integrated Circuits (ICs); Stock 1: 12500; Pricing 1: 2500=1.62792 (USD); Packaging: Tape & Reel (TR); Type: Clock/Calendar; Features: Leap Year, NVSRAM, Square Wave Output; Operating Temperature: -40°C ~ 85°C; Mounting Type: Surface Mount; Package / Case: 8-SOIC (0.154", 3.90mm Width); Supplier Device Package: 8-SOIC N; ComponentLink1URL: http://datasheets.maximintegrated.com/en/ds/DS1307.pdf; ComponentLink1Description: http://datasheets.maximintegrated.com/en/ds/DS1307.pdf
X1 = XT2: Crystal For all Crystal 2pin.; Value: 4Mhz
Y1 = AB38T-32.768KHZ: CRYSTAL 32.7680KHZ 12.5PF T/H; Manufacturer: Abracon LLC; Frequency Tolerance: ±20ppm; ESR (Equivalent Series Resistance): 30 kOhm; Operating Mode: Fundamental; Supplier 1: Digi-Key; Manufacturer Part Number: AB38T-32.768KHZ; RoHS: RoHS Compliant; Category: Crystals and Oscillators; Stock 1: 38720; Pricing 1: 1=0.17, 10=0.145, 50=0.1306, 100=0.116, 500=0.1102, 1000=0.0928, 2500=0.087, 5000=0.0841, 10000=0.0812 (USD); Packaging: Bulk; Type: kHz Crystal (Tuning Fork); Frequency: 32.768kHz; Frequency Stability: -; Load Capacitance: 12.5pF; Operating Temperature: -10°C ~ 60°C; Ratings: -; Mounting Type: Through Hole; Package / Case: Cylindrical Can, Radial; Size / Dimension: 0.126" Dia x 0.330" L (3.20mm x 8.30mm); Height: 0.327" (8.30mm); ComponentLink1URL: http://www.abracon.com/Resonators/AB38T.pdf; ComponentLink1Description: http://www.abracon.com/Resonators/AB38T.pdf

## Sheet Power.SchDoc
size A
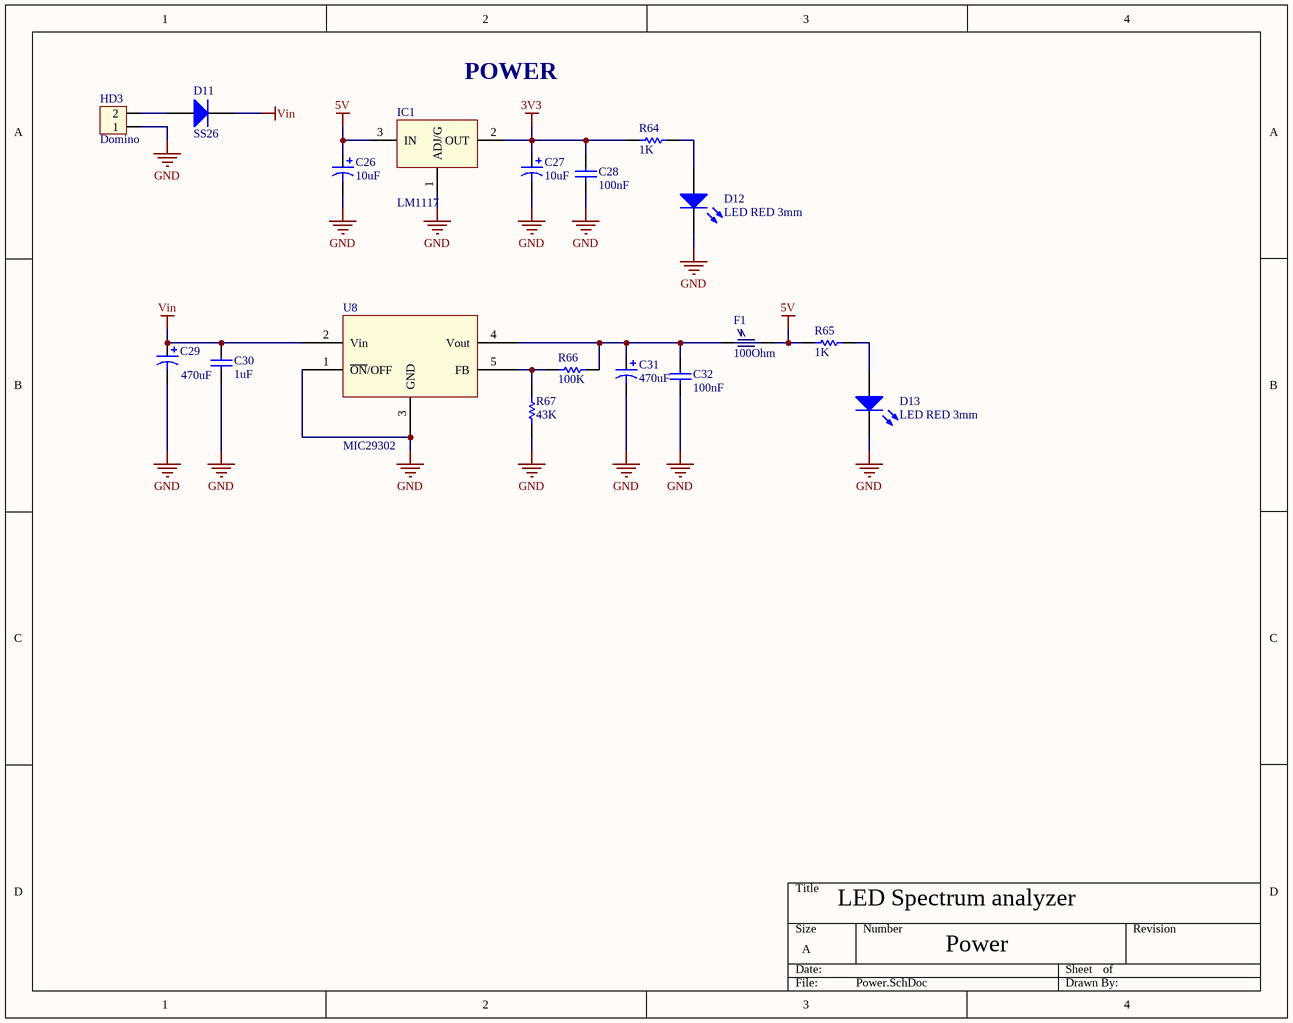
[diagram p2: Power.SchDoc]

### Parts
C26  10uF  [Cap size C]
C27  10uF  [Cap size C]
C28  100nF  [C0805]
C29  470uF  [Cap size X]
C30  1uF  [C0805]
C31  470uF  [Cap size X]
C32  100nF  [C0805]
D11  SS26  [DO-214AA SMB]
D12  LED RED 3mm  [led0805]
D13  LED RED 3mm  [led0805]
F1  100Ohm  [BL02RN1]
HD3  Domino  [HED2]
IC1  LM1117  [SOT223-4N]
R64  1K  [R0805]
R65  1K  [R0805]
R66  100K  [R0805]
R67  43K  [R0805]
U8  MIC29302  [TO-263 5pin]

### Nets
3V3: C27.1(+) C28.2 IC1.2(OUT) R64.2
5V: C26.1(+) F1.2(out) IC1.3(IN) R65.2
GND: C26.2(-) C27.2(-) C28.1 C29.2 C30.1 C31.2(-) C32.1 D12.2(K) D13.2(K) HD3.1 IC1.1(ADJ/G) R67.1 U8.1(~{ON}/OFF) U8.3(GND) U8.6(TAP)
Vin: C29.1 C30.2 D11.2(K) U8.2(Vin)
NetC31_1: C31.1(+) C32.2 F1.1(in) R66.1 U8.4(Vout)
NetD11_1: D11.1(A) HD3.2
NetD12_1: D12.1(A) R64.1
NetD13_1: D13.1(A) R65.1
NetR66_2: R66.2 R67.2 U8.5(FB)

### Notes on the sheet
- POWER
- LED Spectrum analyzer
- Power

### Library data of the parts
C26 C27 C31 = 10uF/25V/RADIAL 5X11/20%: as C3 on sheet BuzzerWithRelay; Supplier 1: Mouser; RoHS: RoHS Compliant; Category: Aluminum Electrolytic Capacitors - Leaded; Stock 1: 19378; Pricing 1: 1=0.288, 10=0.117, 100=0.069, 1000=0.061, 2500=0.053, 10000=0.050, 25000=0.048, 50000=0.045 (AUD); Capacitance: 10 uF; Diameter: 5 mm; Dimensions: 5 mm Dia. x 11 mm L; Length: 11 mm; Package / Case: Radial, Can; Packaging: Bulk; Product: General Purpose Electrolytic Capacitors; Series: M; Termination Style: Radial; Voltage Rating DC: 25 V; Brand: Panasonic; Lead Spacing: 2 mm; Lead Style: Straight; Maximum Operating Temperature: + 85 C; Product Category: Radial Electrolytic Aluminum Capacitors; Standard Pack Qty: 200; RoHS - Mouser: Y; Minimum Order Quantity: 1; Reeling: False; ComponentLink1URL: http://www.mouser.com/ds/2/315/ABA0000CE12-465472.pdf; ComponentLink1Description: http://www.mouser.com/ds/2/315/ABA0000CE12-465472.pdf
C28 C30 C32 = 0.1uF/25V/C0603/10%: as C16 on sheet MCU_RF; Supplier 1: Digi-Key; RoHS: RoHS Compliant; Category: Capacitors; Stock 1: 8148157; Pricing 1: 1=0.1, 10=0.019, 50=0.0104, 100=0.0088, 250=0.0072, 500=0.00616, 1000=0.0048 (USD); Packaging: Cut Tape (CT); Tolerance: ±10%; Voltage - Rated: 25V; Temperature Coefficient: X7R; Mounting Type: Surface Mount, MLCC; Operating Temperature: -55°C ~ 125°C; Applications: General Purpose; Ratings: -; Package / Case: 0603 (1608 Metric); Size / Dimension: 0.063" L x 0.031" W (1.60mm x 0.80mm); Height - Seated (Max): -; Thickness (Max): 0.035" (0.90mm); Lead Spacing: -; Features: -; Lead Style: -; ComponentLink1URL: http://www.murata.com/~/media/webrenewal/support/library/catalog/products/capacitor/mlcc/c02e.ashx; ComponentLink1Description: http://www.murata.com/~/media/webrenewal/support/library/catalog/products/capacitor/mlcc/c02e.ashx
C29 = 220uF/50V/RADIAL 8X11.5/20%: CAP ALUM 220UF 20% 50V RADIAL; Manufacturer: Panasonic Electronic Components; Manufacturer Part Number: EEU-EB1H221; Capacitance: 220µF; Lifetime @ Temp.: 10000 Hrs @ 105°C; Ripple Current: 234mA; Supplier 1: Digi-Key; RoHS: RoHS Compliant; Category: Capacitors; Stock 1: 15029; Pricing 1: 1=0.72, 10=0.51, 25=0.4356, 50=0.3858, 100=0.336, 250=0.2862, 500=0.24888, 1000=0.2074, 2500=0.1952 (USD); Packaging: Bulk; Tolerance: ±20%; Voltage Rating: 50V; ESR (Equivalent Series Resistance): -; Operating Temperature: -40°C ~ 105°C; Type: -; Applications: General Purpose; Impedance: -; Lead Spacing: 0.197" (5.00mm); Size / Dimension: 0.394" Dia (10.00mm); Height - Seated (Max): 0.630" (16.00mm); Surface Mount Land Size: -; Mounting Type: Through Hole; Package / Case: Radial, Can; ComponentLink1URL: http://media.digikey.com/pdf/Data%20Sheets/Panasonic%20Electronic%20Components/EB_Series_Rev2013.pdf; ComponentLink1Description: http://media.digikey.com/pdf/Data%20Sheets/Panasonic%20Electronic%20Components/EB_Series_Rev2013.pdf; Supplier Part Number 1: P13131-ND
D11 = Diode 1N4007: 1 Amp General Purpose Rectifier; Muf: Vishay/USA; Property: Diode; Ordering: SS26; Price: 0.51RMB; Des: *
D12 D13 = LED RED 3mm: LED RED DIFFUSED 3MM ROUND; Manufacturer: Panasonic Electronic Components; Manufacturer Part Number: LN28RPX; Wavelength - Peak: 700nm; Millicandela Rating: 2.8mcd; Voltage - Forward (Vf) (Typ): 2.2V; Current - Test: 15mA; Lens Style/Size: Round with Domed Top, 3mm (T-1), 3.00mm; Supplier 1: Digi-Key; RoHS: RoHS Compliant; Category: Diode; Stock 1: 133031; Pricing 1: 1=0.43, 10=0.339, 25=0.2864, 100=0.233, 250=0.19304, 500=0.15974, 1000=0.11981, 2500=0.10982, 5000=0.10317 (USD); Packaging: Bulk; Color: Red; Wavelength - Dominant: -; Viewing Angle: -; Lens Transparency: Diffused; Lens Color: Red; Package / Case: Radial; Supplier Device Package: 3mm Round; Size / Dimension: -; Height (Max): 5.70mm; Mounting Type: Through Hole; ComponentLink1URL: http://industrial.panasonic.com/www-cgi/jvcr13pz.cgi?E+SC+4+ATA7001+LN28RPX+8+WW; ComponentLink1Description: http://industrial.panasonic.com/www-cgi/jvcr13pz.cgi?E+SC+4+ATA7001+LN28RPX+8+WW; Supplier Part Number 1: P563-ND
F1 = Ferrite EMI: Dec: EMI Suppression Filters  (Lead Type EMIFIL); Muf: Murata/Japan; Ordering: BL02RN1R2M2B; Property: EMI Fliter
HD3 = Hed2: Header 2 (Green); Value: Header 2
IC1 = LM1117: Available in 1.8V, 2.5V, 2.85V, 3.3V, 5V, and  Adjustable Versions; Value: LM317
R64-R67 = 1K/R0805/1%: RES SMD 1K OHM 1% 1/8W 0805; Manufacturer: Yageo; Manufacturer Part Number: RC0805FR-071KL; Power (Watts): 0.125W, 1/8W; Temperature Coefficient: ±100ppm/°C; Supplier 1: Digi-Key; RoHS: RoHS Compliant; Category: Resistors; Stock 1: 2365000; Pricing 1: 5000=0.00247, 10000=0.00215, 25000=0.00189, 50000=0.00173, 125000=0.00169 (USD); Packaging: Tape & Reel (TR); Resistance (Ohms): 1k; Tolerance: ±1%; Composition: Thick Film; Features: Moisture Resistant; Operating Temperature: -55°C ~ 155°C; Package / Case: 0805 (2012 Metric); Supplier Device Package: 0805; Size / Dimension: 0.079" L x 0.049" W (2.00mm x 1.25mm); Height: 0.024" (0.60mm); Number of Terminations: 2; ComponentLink1URL: http://www.yageo.com/NewPortal/yageodocoutput?fileName=/pdf/R-Chip/PYu-RC_Group_51_RoHS_L_3.pdf; ComponentLink1Description: http://www.yageo.com/NewPortal/yageodocoutput?fileName=/pdf/R-Chip/PYu-RC_Group_51_RoHS_L_3.pdf; Supplier Part Number 1: 311-1.00KCRTR-ND
U8 = MIC29302: High-Current Low-Dropout Regulators

## Nets that join several sheets
3V3: BuzzerWithRelay (R13.1 R14.1), MCU_RF (38 pins), Power (C27.1 C28.2 IC1.2 R64.2)
5V: BuzzerWithRelay (14 pins), MCU_RF (18 pins), Power (C26.1 F1.2 IC1.3 R65.2)
GND: BuzzerWithRelay (37 pins), MCU_RF (42 pins), Power (15 pins)
Relay: BuzzerWithRelay (R17.1), MCU_RF (U3.4)
SIM900_PWR: BuzzerWithRelay (R5.1), MCU_RF (U3.41)
SIM900_RESET: BuzzerWithRelay (R18.1), MCU_RF (U3.40)
SIM900_RXD: BuzzerWithRelay (U1.9), MCU_RF (Q14.3 R61.2)
SIM900_TXD: BuzzerWithRelay (R13.2 U1.10), MCU_RF (Q12.3 R57.2)
Speaker_Large: BuzzerWithRelay (R26.1), MCU_RF (U3.3)
Speaker_Small: BuzzerWithRelay (R7.1), MCU_RF (U3.2)